# Altium project IC-MH.PrjPcb
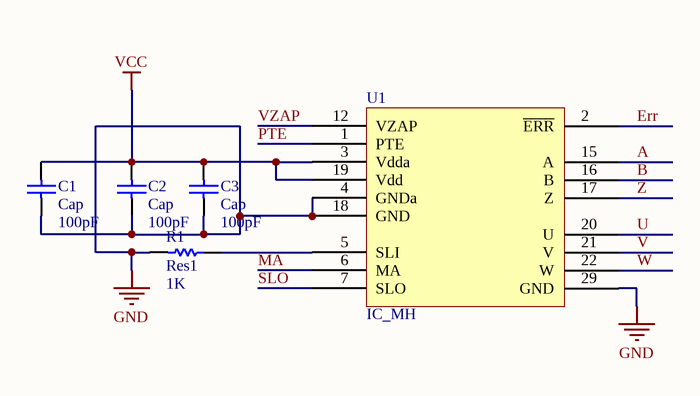
[diagram p0: Sheet2.SchDoc]
1 sheet, 5 parts. Net scope: global (net labels, ports and power ports of the same name join across sheets).
Board file: PCB2.PcbDoc

## Sheet Sheet2.SchDoc
size A4

### Parts
C1  Cap  value 100pF  [ERA-0603]
C2  Cap  value 100pF  [ERA-0603]
C3  Cap  value 100pF  [ERA-0603]
R1  Res1  value 1K  [ERA-0603]
U1  IC_MH  [QFN28-2]

### Nets
GND: C1.1 C2.1 C3.1 R1.2 U1.4(GNDa) U1.18(GND) U1.29(GND)
VCC: C1.2 C2.2 C3.2 U1.3(Vdda) U1.19(Vdd)
A: U1.15(A)
B: U1.16(B)
Err: U1.2(~{ERR})
MA: U1.6(MA)
PTE: U1.1(PTE)
SLO: U1.7(SLO)
U: U1.20(U)
V: U1.21(V)
VZAP: U1.12(VZAP)
W: U1.22(W)
Z: U1.17(Z)
NetR1_1: R1.1 U1.5(SLI)

### Library data of the parts
C1-C3 = Cap: Capacitor; Published: 8-Jun-2000; LatestRevisionDate: 17-Jul-2002; LatestRevisionNote: Re-released for DXP Platform.; PackageReference: RAD-0.3; Publisher: Altium Limited; PackageDescription: Radial Cap, Thru-Hole; 2 Leads; 0.3 in Pin Spacing
R1 = Res1: Resistor; Published: 8-Jun-2000; LatestRevisionDate: 17-Jul-2002; LatestRevisionNote: Re-released for DXP Platform.; PackageReference: AXIAL-0.3; Publisher: Altium Limited; PackageDescription: Axial Device, Thru-Hole; 2 Leads; 0.3 in Pin Spacing